# EAGLE design Planta_1 inestable (EAGLE 7.6.0)
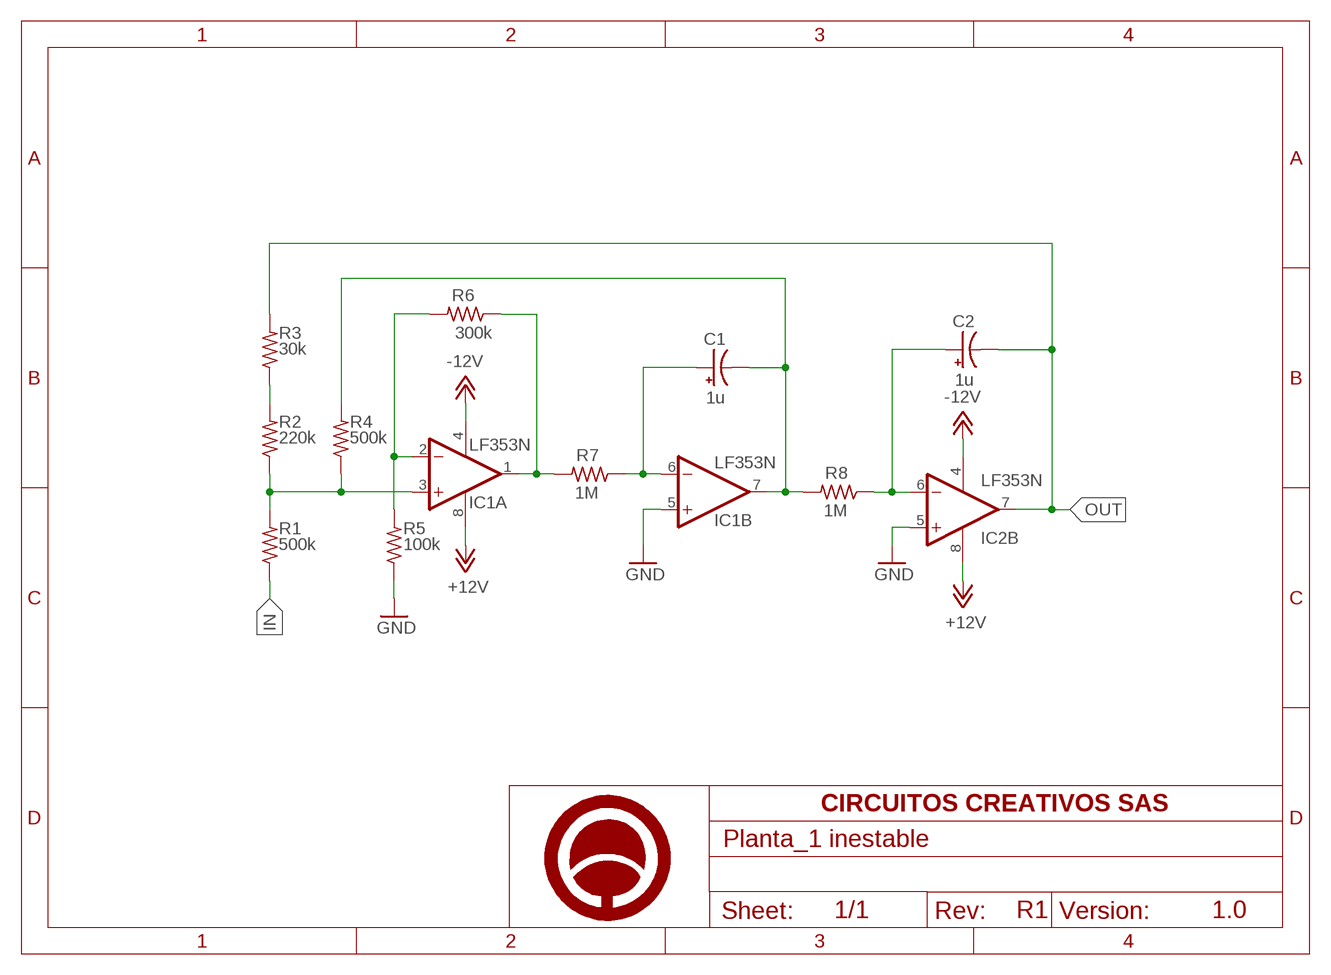
[diagram p0: schematic, sheet 1]

## Parts
C1  1u  CPOL-USE2-5  [E2-5]
C2  1u  CPOL-USE2-5  [E2-5]
IC1  LF353N  [DIL08]
IC2  LF353N  [DIL08]
R1  500k  R-US_0204/7  [0204/7]
R2  220k  R-US_0204/7  [0204/7]
R3  30k  R-US_0204/7  [0204/7]
R4  500k  R-US_0204/7  [0204/7]
R5  100k  R-US_0204/7  [0204/7]
R6  300k  R-US_0204/7  [0204/7]
R7  1M  R-US_0204/7  [0204/7]
R8  1M  R-US_0204/7  [0204/7]
U$1  LOGO  [LOGO]

## Nets
+12V: IC1.8(P:V+) IC2.8(P:V+)
-12V: IC1.4(P:V-) IC2.4(P:V-)
GND: IC1.5(B:+IN) IC2.5(B:+IN) R5.1
IN: R1.1
N$1: IC1.3(A:+IN) R1.2 R2.1 R4.1
N$2: R2.2 R3.1
N$3: IC1.2(A:-IN) R5.2 R6.2
N$4: IC1.1(A:OUT) R6.1 R7.2
N$5: C1.+ IC1.6(B:-IN) R7.1
N$6: C1.- IC1.7(B:OUT) R4.2 R8.2
N$7: C2.+ IC2.6(B:-IN) R8.1
OUT: C2.- IC2.7(B:OUT) R3.2
Unconnected: IC2.1(A:OUT) IC2.2(A:-IN) IC2.3(A:+IN)

## Notes on the sheet
- CIRCUITOS CREATIVOS SAS
- R1 | 1.0

## Library data of the parts
C1 C2 = rcl:CPOL-US: POLARIZED CAPACITOR, American symbol
IC1 IC2 = linear:LF353: OP AMP
R1-R8 = rcl:R-US_: RESISTOR, American symbol
U$1 = Circuitos-Creativos-Estilos:LOGO: Logo oficial de la compañia

## Board
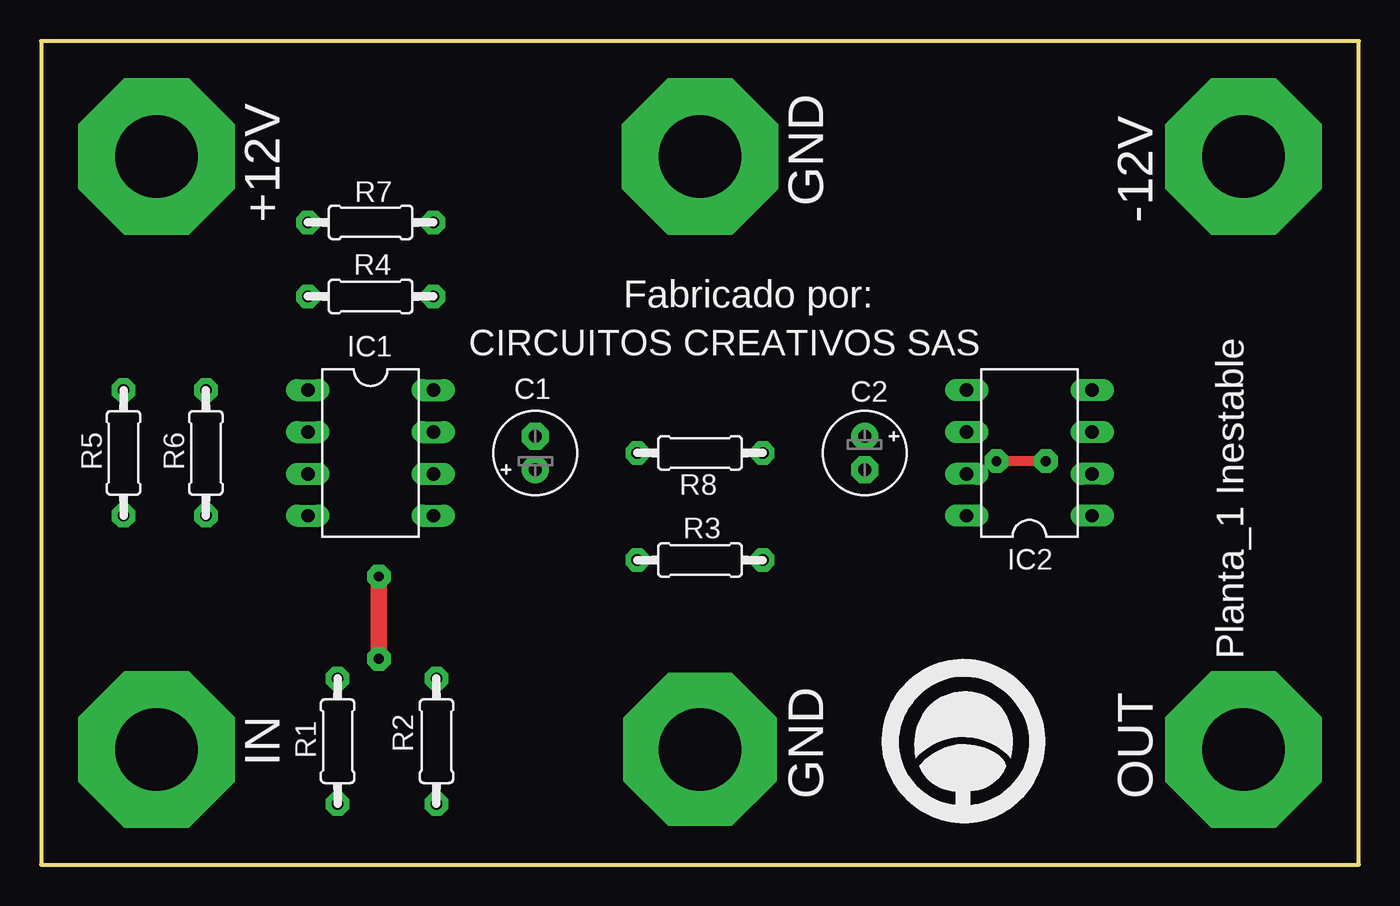
[diagram p1: board, top side]
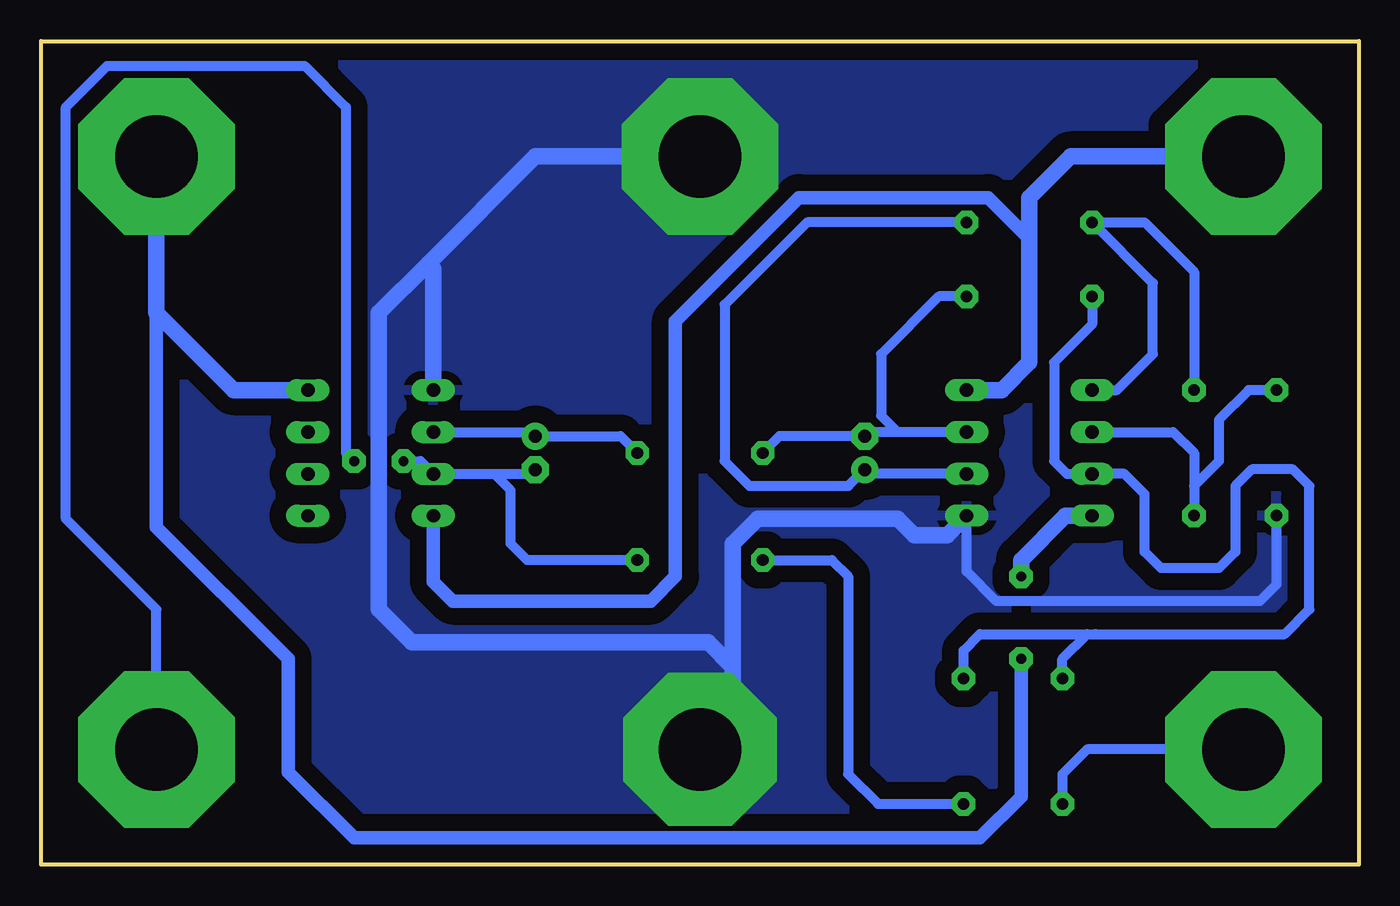
[diagram p2: board, bottom side, seen from below]

Size 80 x 50 mm. Coordinates in mm from the lower left corner, seen from the top.
Outline: 0,0 80,0 80,50 0,50 0,0
Copper layers (1*16): Top 0.035mm / dielectric 1.5mm / Bottom 0.035mm
Design rules "Circuitos_Creativos_2_capas *": minimum track width 0.6mm, minimum drill 0.6mm, track to track 10mil, track to pad 10mil, pad to pad 10mil, via to via 10mil, smd to smd 8mil, copper to edge 1mm, drill to drill 15mil, minimum pad ring 10mil, minimum via ring 8mil, stop-mask expansion 4mil, vias tented up to drill 0mil, thermal gap 20mil

### Footprints (pad centres in the part's own frame; a part is rotated, then mirrored left to right if it is on the bottom)
E2-5 = drill 0.8 pad 1.65: + -1.016,0 | drill 0.8 pad 1.65 octagon: - 1.016,0
DIL08 = drill 0.813 pad 1.27 long: 1 -3.81,-3.81; 2 -1.27,-3.81; 3 1.27,-3.81; 4 3.81,-3.81; 5 3.81,3.81; 6 1.27,3.81; 7 -1.27,3.81; 8 -3.81,3.81
0204/7 = drill 0.7 pad 1.422 octagon: 1 -3.81,0; 2 3.81,0

### Placement (x,y rotation side)
C1  30,25 90 top
C2  50,25 270 top
IC1  20,25 270 top
IC2  60,25 90 top
R1  18,7.5 90 top
R2  24,7.5 270 top
R3  40,18.5 0 top
R4  20,34.5 0 top
R5  5,25 90 top
R6  10,25 270 top
R7  20,39 180 top
R8  40,25 180 top
U$1  56,7.5 0 top

### Tracks (layer width: path | path; a pad name or v marks a point on that pad's centre or on a via)
+12V  (via drill 5 pad 9.5)
  Bottom 0.813: IC2.8 56.19,17.19 55,16 43,16 41.5,17.5 41.5,33 34,40.5 22.5,40.5 20,38
  Bottom 1.016: v7,43 17.5,43 20,40.5 20,38 20,30.5 21.69,28.81 IC1.8
-12V  (via drill 0.6 pad 1.42, 5 pad 9.5)
  Top 1.016: v20.5,17.5 v20.5,12.5
  Bottom 0.813: v20.5,12.5 20.5,4.12 23,1.62 61,1.62 65,5.62 65,12.5 73,20.5 73,33.5
  Bottom 1.016: v73,43 73,33.5 68.31,28.81 IC2.4 | IC1.4 17.81,21.19 20.5,18.5 v20.5,17.5
GND  (via drill 5 pad 9.3, 5 pad 9.5)
  Bottom 0.61: R5.1 5,17 6,16 22,16 23.81,17.81 IC1.5
  Bottom 1.016: v40,43 50,43 56.5,36.5 | 56.5,36.5 59.5,33.5 59.5,15.5 57.5,13.5 39.5,13.5 38,12 | IC1.5 25,20 27,20 28,21 36.5,21 38,19.5 38,12 | 38,12 38,9 v40,7 | IC2.5 56.19,36.19 56.5,36.5
  pour Bottom (isolate 1.016): -1,-1 81,-1 81,51 -1,51
IN  (via drill 5 pad 9.5)
  Bottom 0.61: v7,7 16.5,7 18,5.5 R1.1
N$1
  Bottom 0.61: R1.2 18,12.5 16.5,14 | 16.5,14 16,14 4.5,14 3,15.5 3,23 4,24 6.5,24 7.5,23 7.5,19 8.5,18 12,18 13,19 13,22.5 14.23,23.73 IC1.3 17.73,23.73 18.5,24.5 18.5,30.5 16.19,32.81 R4.1 | R2.1 24,13 23,14 16.5,14
N$2
  Bottom 0.61: R3.1 32,18.5 31,17.5 31,5.5 29.19,3.69 R2.2
N$3
  Bottom 0.61: IC1.2 11.27,26.27 10,25 10,23 | 10,23 R6.2 | R5.2 6.69,28.81 8.5,27 8.5,24.5 10,23
N$4
  Bottom 0.61: R6.1 10,36 13,39 R7.2 12.5,35.31 12.5,31 14.69,28.81 IC1.1
N$5
  Bottom 0.61: IC1.6 29.75,23.73 C1.+ 30.98,23 37,23 38.5,24.5 38.5,34 33.5,39 R7.1
N$6
  Bottom 0.61: IC1.7 28,26.27 | 28,26.27 29.75,26.27 C1.- 35.17,26.02 R8.2 | R4.2 25.5,34.5 29,31 29,27.27 28,26.27
N$7
  Bottom 0.61: IC2.6 50.25,26.27 C2.+ 44.83,26.02 R8.1
OUT  (via drill 0.6 pad 1.42, 5 pad 9.5)
  Top 0.61: v61,24.5 v58,24.5
  Bottom 0.61: 52.5,23.73 IC2.7 56.96,24.5 v58,24.5 | 52.5,23.73 50.25,23.73 C2.- | R3.2 50.5,18.5 51.5,19.5 51.5,22.73 52.5,23.73 | v73,7 73,15.5 78.5,21 78.5,46 76,48.5 64,48.5 61.5,46 61.5,25 v61,24.5

### Text on the board
tPlace: GND | +12V | -12V | Fabricado por: | CIRCUITOS CREATIVOS SAS | Planta_1 Inestable | IN | GND | OUT